# Altium schematic sheet servo.SchDoc
size A4
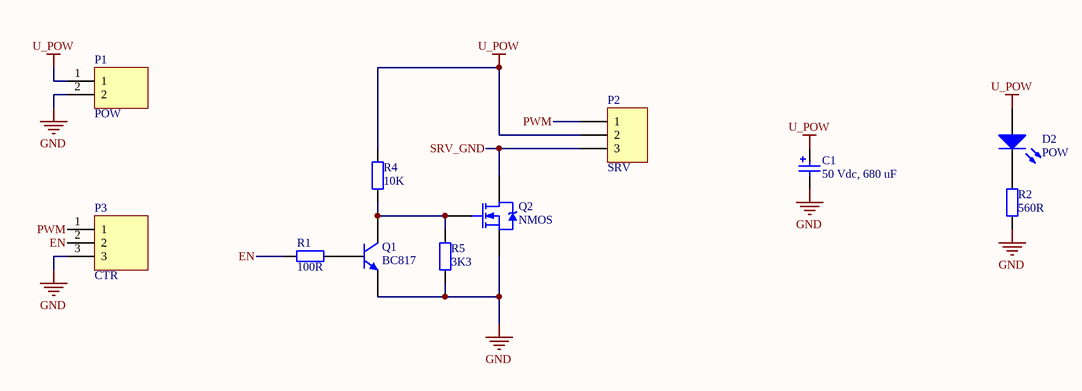
[diagram p0: servo.SchDoc]

## Parts
C1  50 Vdc, 680 uF  [WCAP-ATG8_13x20x5]
D2  POW  [FP_0805_LED_RED]
P1  POW  [FP_CONN2_TAP_254MM_90_EDGE]
P2  SRV  [HDR1X3]
P3  CTR  [FP_CONN3_TAP_254MM_90_EDGE]
Q1  BC817  [FP_SOT23-3]
Q2  NMOS  [FP_DPAK-TO252]
R1  100R  [FP_0805_RES]
R2  560R  [FP_0805_RES]
R4  10K  [FP_0805_RES]
R5  3K3  [FP_0805_RES]

## Nets
GND: C1.2(N) P1.2 P3.3 Q1.2(E) Q2.3(S) R2.1 R5.1
U_POW: C1.1(P) D2.1(A) P1.1 P2.2 R4.2
EN: P3.2 R1.1
PWM: P2.1 P3.1
SRV_GND: P2.3 Q2.2(D)
NetD2_2: D2.2(K) R2.2
NetQ1_1: Q1.1(B) R1.2
NetQ1_3: Q1.3(C) Q2.1(G) R4.1 R5.2

## Library data of the parts
C1 = ELKO 860010678022: WCAP-ATG8 Aluminum Electrolytic Capacitors, 13x20mm, 50 Vdc, 680 uF; Rated Voltage: 50 Vdc; Value: 680 uF; Name: Servo buffer capacitor; ComponentLink1Description: Manufacturer; ComponentLink1URL: http://www.we-online.de; ComponentLink2Description: Datasheet; ComponentLink2URL: http://katalog.we-online.de/pbs/datasheet/860010678022.pdf; Part Number: 860010678022; Published Date: Sep. 2017; Publisher: Wurth Elektronik; Size: 13x20mm; Life Cycle: 2000h; Operating Temperature: -40 °C up to +85 °C; ComponentLink3Description: FArnell.com; ComponentLink3URL: https://hu.farnell.com/wurth-elektronik/860010678022/cap-680-f-50v-20/dp/2465746
D2 = LED: Typical RED GaAs LED; pin to pad: 1>A 2>K; Name: LED - 2012 RED 630nm 140mcd HL-PSC-2012S9AC; Supplier: Lomex; Reference: 95-03-83
P1 = Connector_2pin: 2pin connector; Name: TÁPCSATL. 2.54mm 2P APA 90°; Reference: 43-09-94; Supplier: Lomex
P2 = Header 3H: Header, 3-Pin, Right Angle; Name: 90° pin header; LatestRevisionDate: 17-Jul-2002; LatestRevisionNote: Re-released for DXP Platform.; Publisher: Altium Limited
P3 = Connector_3pin: 3pin connector; Name: TÁPCSATL. 2.54mm 3P APA 90°; Reference: 43-09-95; Supplier: Lomex
Q1 = BC817: NPN General-purpose Transistor; Reference: 3020948; Name: Bipolar (BJT) Single Transistor, NPN; ComponentLink1Description: Manufacturer Link; ComponentLink1URL: http://www.semiconductors.philips.com/; ComponentLink2Description: Datasheet; ComponentLink2URL: http://www.semiconductors.philips.com/acrobat/datasheets/BC817_BC817W_BC337_5.pdf; Supplier: Farnell
Q2 = NMOS: Reference: 8651299; Name: MOSFET Transistor, N Channel; Supplier: Farnell
R1 = RES: Resistor; Name: 100R 0805 5% RC0805JR-10100RL; Supplier: Lomex; Reference: 81-34-71; Value: 100R
R2 = RES: Resistor; Name: 560R 0805 5% CR-05JL7; Supplier: Lomex; Reference: 81-10-84; Value: 560R
R4 = RES: Resistor; Name: 10K0 0805 5% RC0805JR-1010KL; Supplier: Lomex; Reference: 81-34-76; Value: 10K
R5 = RES: Resistor; Name: 3K30 0805 5% CR-05JL7; Supplier: Lomex; Reference: 81-10-93; Value: 3K3